# Altium project LimeSDR-Micro_M.2_2280_1v0.PrjPcb (part 10 of 10)
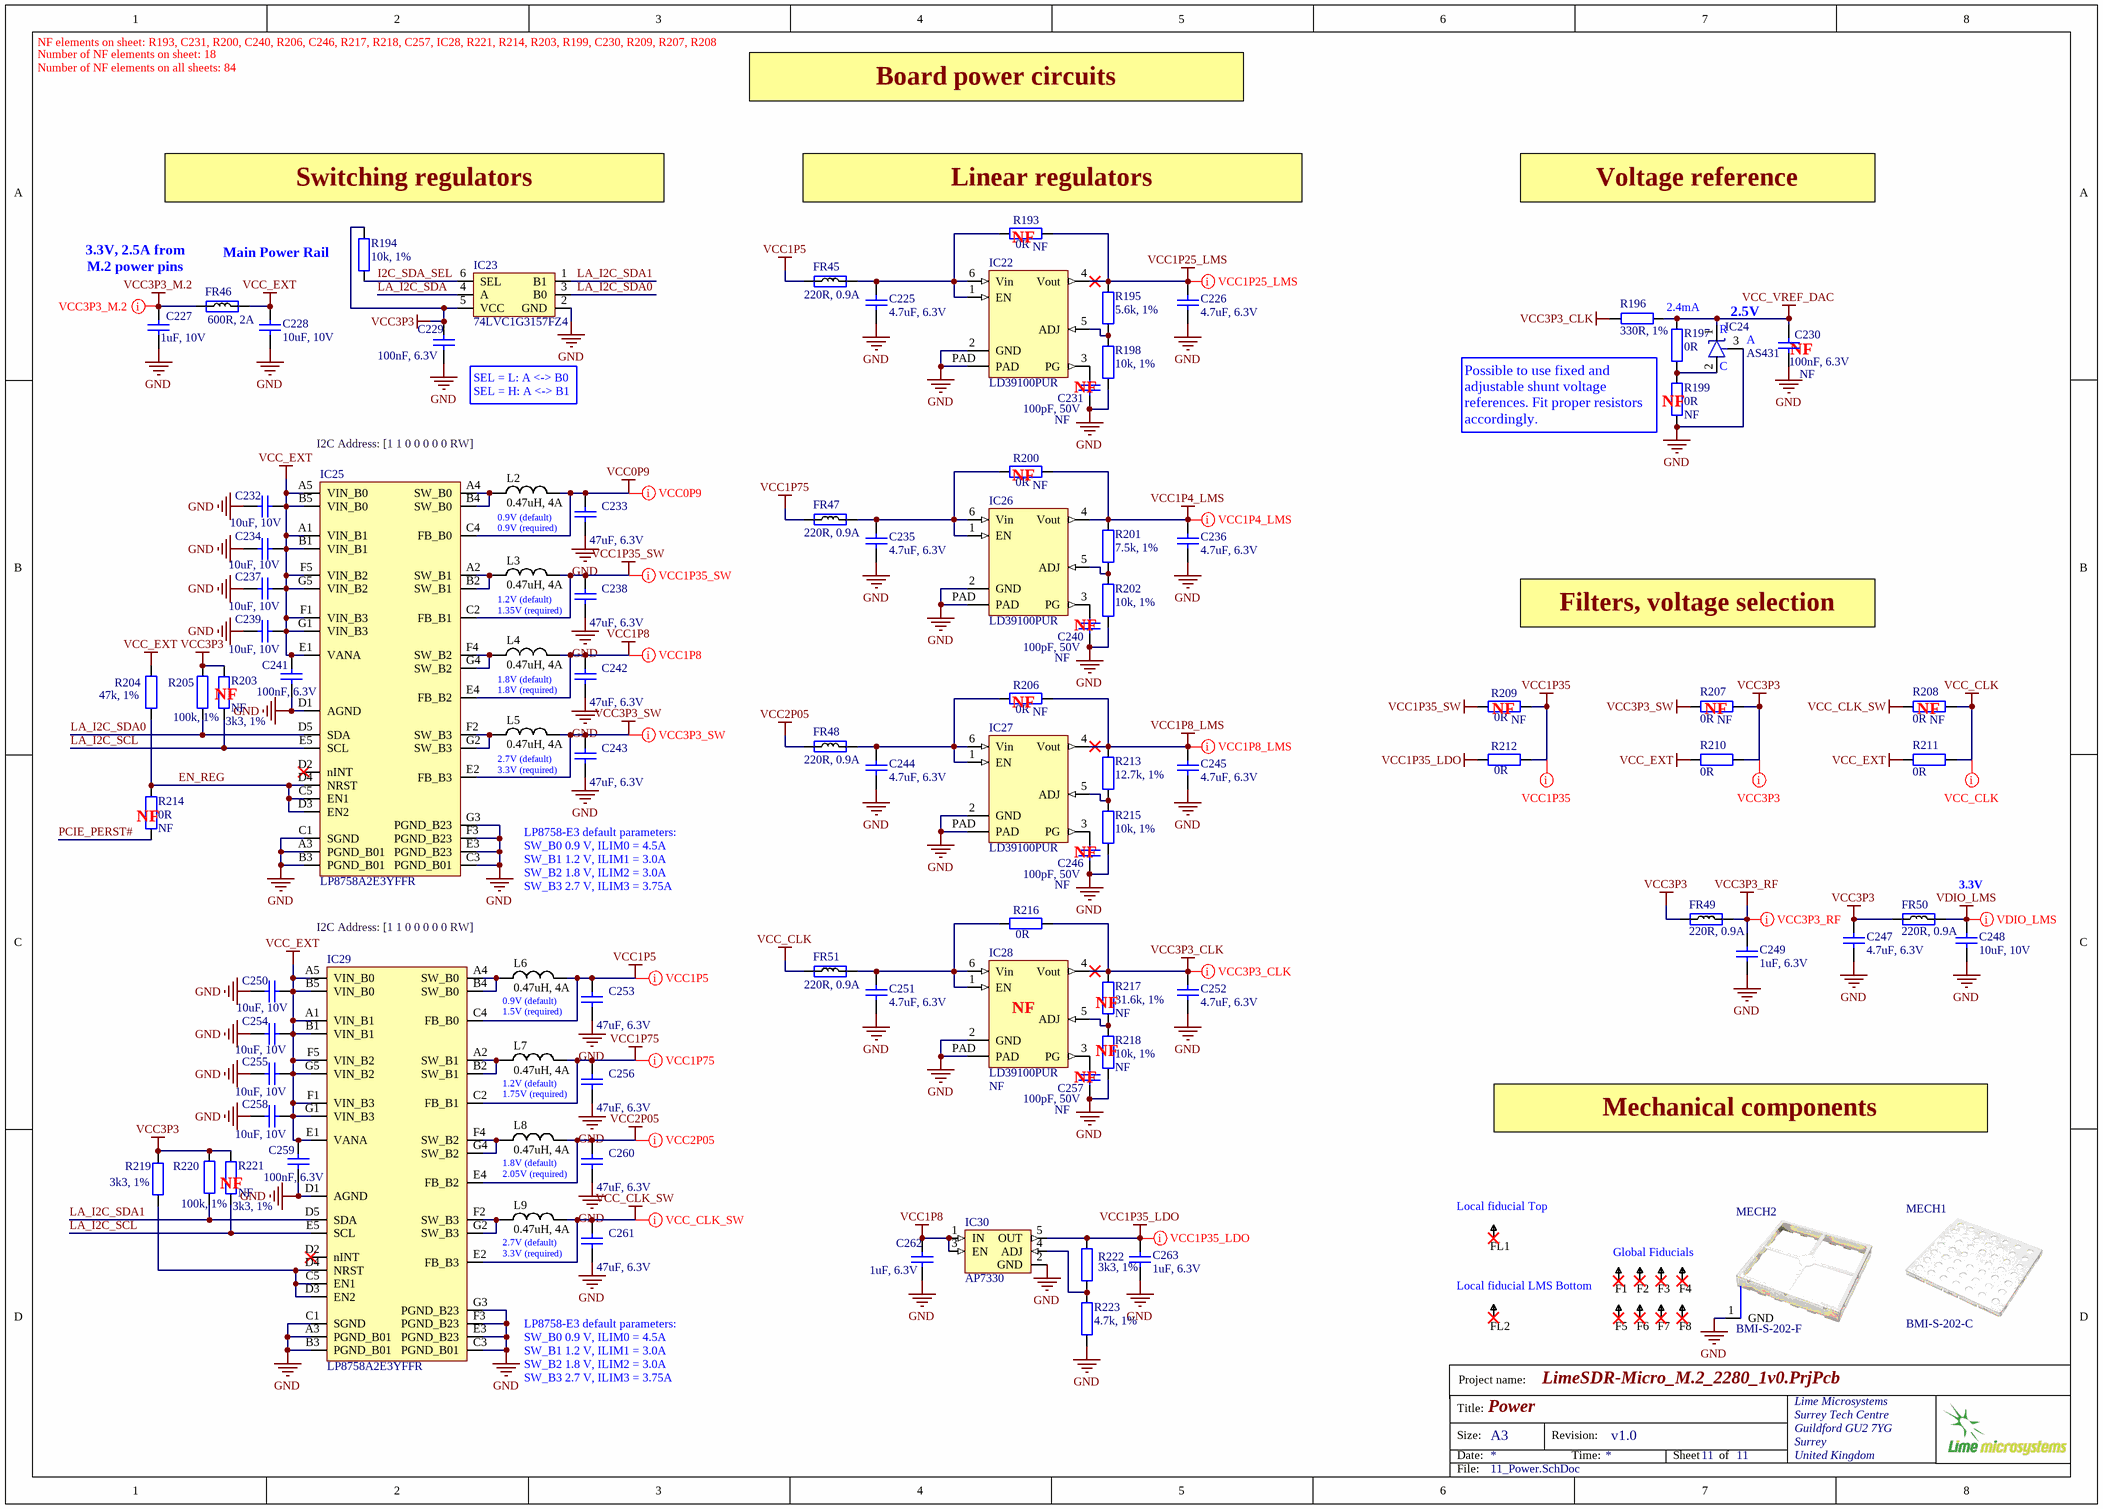
[diagram p16: 11_Power.SchDoc]

## Sheet 11_Power.SchDoc: Power (continued)

### Library data of the parts (continued)
R217 = Res_0402: Manufacturer: Yageo; Manufacturer Part Number 1: RC0201FR-0731K6L; Part Description: 31.6 kOhms ±1% 0.05W, 1/20W Chip Resistor 0201 (0603 Metric) Moisture Resistant Thick Film; Resistance: 31.6kR; Max Power Dissipation: 50mW; Temperature Coefficient: 200ppm/°C; Value: 31.6k, 1%; ComponentLink1URL: https://datasheet.ciiva.com/5924/1563626-5924912.pdf?src-supplier=Farnell; ComponentLink1Description: https://datasheet.ciiva.com/5924/1563626-5924912.pdf?src-supplier=Farnell; ComponentLink2URL: https://datasheet.ciiva.com/22661/1563626-22661319.pdf?src-supplier=Element14; ComponentLink2Description: https://datasheet.ciiva.com/22661/1563626-22661319.pdf?src-supplier=Element14; ComponentLink3URL: https://datasheet.ciiva.com/7660/1421516-7660807.pdf?src-supplier=Element14; ComponentLink3Description: https://datasheet.ciiva.com/7660/1421516-7660807.pdf?src-supplier=Element14; ComponentLink4URL: https://datasheet.ciiva.com/46391/1421516-46391339.pdf?src-supplier=Element14; ComponentLink4Description: https://datasheet.ciiva.com/46391/1421516-46391339.pdf?src-supplier=Element14; ComponentLink5URL: https://datasheet.ciiva.com/2467/pyu-r-int-thick-7-2467110.pdf?src-supplier=Digi-Key; ComponentLink5Description: https://datasheet.ciiva.com/2467/pyu-r-int-thick-7-2467110.pdf?src-supplier=Digi-Key; ComponentLink6URL: https://datasheet.ciiva.com/2467/pyu-r-int-thick-7-2467111.pdf?src-supplier=Digi-Key; ComponentLink6Description: https://datasheet.ciiva.com/2467/pyu-r-int-thick-7-2467111.pdf?src-supplier=Digi-Key; ComponentLink7URL: https://datasheet.ciiva.com/2467/pyu-r-int-thick-7-2467109.pdf?src-supplier=Digi-Key; ComponentLink7Description: https://datasheet.ciiva.com/2467/pyu-r-int-thick-7-2467109.pdf?src-supplier=Digi-Key; Supplier 1: Digi-Key; Supplier Part Number 1: YAG2597CT-ND; Stock 1: 255391; Pricing 1: 1=0,10000, 10=0,03700, 100=0,01500, 1000=0,00672, 2500=0,00583, 5000=0,00482 (USD); RoHS: Yes; Case/Package: 0201; Case Code (Metric): 0603; Case Code (Imperial): 0201; Min Operating Temperature: -55°C; Max Operating Temperature: 125°C; Packaging: Tape and Reel; Resistor Type: Thick Film; Number of Terminations: 2; Tolerance: 1%; Features: Moisture Resistant; Length: 0.024inch; Width: 0.012inch; Height: 0.01inch; RoHS Compliant: Yes; ComponentLink8URL: http://www.yageo.com/documents/recent/PYu-RC_Group_51_RoHS_L_10.pdf?src-supplier=Digi-Key; ComponentLink8Description: http://www.yageo.com/documents/recent/PYu-RC_Group_51_RoHS_L_10.pdf?src-supplier=Digi-Key; ComponentLink9URL: https://www.yageo.com/upload/media/product/productsearch/datasheet/rchip/PYu-RC_Group_51_RoHS_L_11.pdf?src-supplier=Digi-Key; ComponentLink9Description: https://www.yageo.com/upload/media/product/productsearch/datasheet/rchip/PYu-RC_Group_51_RoHS_L_11.pdf?src-supplier=Digi-Key; ComponentLink10URL: http://www.yageo.com/documents/recent/PYu-RC_Group_51_RoHS_L_9.pdf?src-supplier=Digi-Key; ComponentLink10Description: http://www.yageo.com/documents/recent/PYu-RC_Group_51_RoHS_L_9.pdf?src-supplier=Digi-Key
R223 = Res_0402: Manufacturer: Yageo; Manufacturer Part Number 1: RC0201FR-074K7L; Part Description: 4.7 kOhms ±1% 0.05W, 1/20W Chip Resistor 0201 (0603 Metric) Moisture Resistant Thick Film; Resistance: 4.7kR; Power Rating: 50mW; Voltage Rating: 25V; Temperature Coefficient: 200ppm/°C; Value: 4.7k, 1%; ComponentLink1URL: https://datasheet.ciiva.com/5924/1563626-5924912.pdf?src-supplier=Farnell; ComponentLink1Description: https://datasheet.ciiva.com/5924/1563626-5924912.pdf?src-supplier=Farnell; ComponentLink2URL: https://datasheet.ciiva.com/22661/1563626-22661319.pdf?src-supplier=Element14; ComponentLink2Description: https://datasheet.ciiva.com/22661/1563626-22661319.pdf?src-supplier=Element14; ComponentLink3URL: https://datasheet.ciiva.com/7672/1563626-7672202.pdf?src-supplier=Element14; ComponentLink3Description: https://datasheet.ciiva.com/7672/1563626-7672202.pdf?src-supplier=Element14; ComponentLink4URL: https://datasheet.ciiva.com/2493/pyu-r-int-thick-7-2493785.pdf?src-supplier=Digi-Key; ComponentLink4Description: https://datasheet.ciiva.com/2493/pyu-r-int-thick-7-2493785.pdf?src-supplier=Digi-Key; ComponentLink5URL: https://datasheet.ciiva.com/2493/pyu-r-int-thick-7-2493786.pdf?src-supplier=Digi-Key; ComponentLink5Description: https://datasheet.ciiva.com/2493/pyu-r-int-thick-7-2493786.pdf?src-supplier=Digi-Key; ComponentLink6URL: https://datasheet.ciiva.com/2493/pyu-r-int-thick-7-2493784.pdf?src-supplier=Digi-Key; ComponentLink6Description: https://datasheet.ciiva.com/2493/pyu-r-int-thick-7-2493784.pdf?src-supplier=Digi-Key; ComponentLink7URL: https://datasheet.ciiva.com/7672/1563626-7672233.pdf?src-supplier=Element14; ComponentLink7Description: https://datasheet.ciiva.com/7672/1563626-7672233.pdf?src-supplier=Element14; ComponentLink8URL: https://datasheet.ciiva.com/2493/pyu-r-int-thick-7-2493812.pdf?src-supplier=Digi-Key; ComponentLink8Description: https://datasheet.ciiva.com/2493/pyu-r-int-thick-7-2493812.pdf?src-supplier=Digi-Key; ComponentLink9URL: https://datasheet.ciiva.com/2493/pyu-r-int-thick-7-2493813.pdf?src-supplier=Digi-Key; ComponentLink9Description: https://datasheet.ciiva.com/2493/pyu-r-int-thick-7-2493813.pdf?src-supplier=Digi-Key; ComponentLink10URL: https://datasheet.ciiva.com/2493/pyu-r-int-thick-7-2493811.pdf?src-supplier=Digi-Key; ComponentLink10Description: https://datasheet.ciiva.com/2493/pyu-r-int-thick-7-2493811.pdf?src-supplier=Digi-Key; ComponentLink11URL: https://datasheet.ciiva.com/8892/pyu-rc0201-51-rohs-l-8-8892942.pdf?src-supplier=Avnet; ComponentLink11Description: https://datasheet.ciiva.com/8892/pyu-rc0201-51-rohs-l-8-8892942.pdf?src-supplier=Avnet; Supplier 1: Digi-Key; Supplier Part Number 1: 311-4.70KMCT-ND; Stock 1: 6149397; Pricing 1: 1=0,10000, 10=0,03700, 100=0,01530, 1000=0,00685, 2500=0,00595, 5000=0,00491 (USD); RoHS: Yes; Case/Package: 0201; Case Code (Metric): 0603; Case Code (Imperial): 0201; Weight: 6E-06oz; Contact Plating: Tin,Matte; Size Code: 0201; Min Operating Temperature: -55°C; Max Operating Temperature: 125°C; Tolerance: 1%; Packaging: Tape and Reel; Package Quantity: 1; Resistor Type: Thick Film; Number of Terminations: 2; Termination: SMD/SMT; Max Power Dissipation: 50mW; Features: Moisture Resistant; Series: RC; Resistance Tolerance: 1%; Construction: Rectangular; Length: 0.6mm; Width: 0.012inch; Height: 0.01inch; Depth: 0.3mm; Radiation Hardening: No; Military Standard: Not; Lead Free: Lead Free; RoHS Compliant: Yes

## Nets that join several sheets
GND: 05_LMS7002M_Misc (42 pins), 06_LMS7002M_RF (56 pins), 07_LMS7002M_Power (85 pins), 08_BB_Processor (131 pins), 09_Misc (74 pins), 10_Clock (76 pins), 11_Power (73 pins)
VCC0P9: 08_BB_Processor (16 pins), 11_Power (C233.2 IC25.C4 L2.2)
VCC1P4_LMS: 07_LMS7002M_Power (FR22.2 FR23.2 FR24.2 FR25.2), 11_Power (C236.2 IC26.4 R200.2 R201.1)
VCC1P8: 08_BB_Processor (13 pins), 09_Misc (31 pins), 10_Clock (6 pins), 11_Power (6 pins)
VCC1P8_LMS: 06_LMS7002M_RF (12 pins), 07_LMS7002M_Power (11 pins), 10_Clock (FR41.1), 11_Power (C245.2 IC27.4 R206.2 R213.1)
VCC1P25_LMS: 07_LMS7002M_Power (18 pins), 11_Power (C226.2 IC22.4 R193.2 R195.1)
VCC1P35: 08_BB_Processor (C117.1 R75.2), 11_Power (R209.2 R212.2)
VCC3P3: 05_LMS7002M_Misc (X6.8), 06_LMS7002M_RF (FR1.2), 08_BB_Processor (X13.8), 09_Misc (19 pins), 11_Power (13 pins)
VCC3P3_CLK: 08_BB_Processor (C133.2 C134.1 IC7.1), 09_Misc (FR38.1), 10_Clock (20 pins), 11_Power (5 pins)
VCC3P3_M.2: 08_BB_Processor (R74.1), 09_Misc (5 pins), 11_Power (C227.2 FR46.1)
VCC3P3_RF: 06_LMS7002M_RF (FR2.1 FR3.2 FR4.2), 11_Power (C249.1 FR49.2)
VCC_VREF_DAC: 10_Clock (R167.2), 11_Power (C230.1 IC24.1 R196.1 R197.1)
VDIO_LMS: 05_LMS7002M_Misc (9 pins), 07_LMS7002M_Power (R69.1), 11_Power (C248.2 FR50.2)
ADF_MUXOUT: 09_Misc (IC14.24), 10_Clock (IC20.15 R185.1)
EXT_CLK_CTRL: 09_Misc (IC14.22), 10_Clock (IC16.6)
GNSS_1PPS: 09_Misc (IC11.6), 10_Clock (R175.1)
GNSS_RXD_LS: 08_BB_Processor (IC6.P9), 09_Misc (IC12.3)
GNSS_TXD_LS: 08_BB_Processor (IC6.P10), 09_Misc (IC12.2)
I2C_SDA_SEL: 09_Misc (IC14.28), 11_Power (IC23.6 R194.1)
LA_CFG_BOOT_HO: 08_BB_Processor (IC6.R14), 09_Misc (R119.2 R128.1)
LA_CFG_BOOT_SRC0: 08_BB_Processor (IC6.M14), 09_Misc (IC8.4 R117.2 R125.1 R126.1)
LA_CFG_BOOT_SRC1: 08_BB_Processor (IC6.P15), 09_Misc (R118.2 R127.1)
LA_CFG_PCIE_GEN: 08_BB_Processor (IC6.P13), 09_Misc (R124.2 R133.1)
LA_CFG_RST_HNDSHK: 08_BB_Processor (IC6.P14), 09_Misc (IC9.1 R120.2 R129.1 R136.1)
LA_CFG_TEST_PORT_DIS: 08_BB_Processor (IC6.M15), 09_Misc (IC9.2 R121.2 R130.1 R134.1)
LA_GPIO_05: 08_BB_Processor (IC6.L13), 09_Misc (R137.1)
LA_GPIO_06: 08_BB_Processor (IC6.K15), 09_Misc (R138.1)
LA_I2C_SCL: 05_LMS7002M_Misc (R26.1), 09_Misc (7 pins), 10_Clock (IC18.5), 11_Power (IC25.E5 IC29.E5 R203.2 R221.2)
LA_I2C_SCL_LS: 08_BB_Processor (IC6.P6), 09_Misc (R144.2 VT1.S)
LA_I2C_SDA: 05_LMS7002M_Misc (R30.1), 09_Misc (6 pins), 10_Clock (IC18.6), 11_Power (IC23.4)
LA_I2C_SDA_LS: 08_BB_Processor (IC6.R6), 09_Misc (R147.2 VT2.S)
LA_LED1_LS: 08_BB_Processor (IC6.R11), 09_Misc (IC9.4)
LA_LED2_LS: 08_BB_Processor (IC6.P12), 09_Misc (IC9.3)
LA_PPS_IN_LS: 08_BB_Processor (IC6.K14), 10_Clock (IC19.4 R181.2)
LA_PPS_OUT_LS: 08_BB_Processor (IC6.M8), 09_Misc (R122.2 R131.1), 10_Clock (IC21.4 R192.2)
LA_RX0_I_N: 05_LMS7002M_Misc (R28.1), 08_BB_Processor (IC6.A4)
LA_RX0_I_P: 05_LMS7002M_Misc (R34.1), 08_BB_Processor (IC6.B4)
LA_RX0_Q_N: 05_LMS7002M_Misc (R37.1), 08_BB_Processor (IC6.B6)
LA_RX0_Q_P: 05_LMS7002M_Misc (R42.1), 08_BB_Processor (IC6.A6)
LA_RX1_I_N: 05_LMS7002M_Misc (R44.1), 08_BB_Processor (IC6.B10)
LA_RX1_I_P: 05_LMS7002M_Misc (R49.1), 08_BB_Processor (IC6.A10)
LA_RX1_Q_N: 05_LMS7002M_Misc (R51.1), 08_BB_Processor (IC6.A12)
LA_RX1_Q_P: 05_LMS7002M_Misc (R58.1), 08_BB_Processor (IC6.B12)
LA_SPI_ADF_SS: 09_Misc (IC12.12), 10_Clock (R190.2)
LA_SPI_ADF_SS_LS: 08_BB_Processor (IC6.P11), 09_Misc (IC12.1 R115.2)
LA_SPI_LMS_SS: 05_LMS7002M_Misc (R23.2), 09_Misc (IC12.9)
LA_SPI_LMS_SS_LS: 08_BB_Processor (IC6.P7), 09_Misc (IC12.4 R116.2)
LA_SPI_MISO: 05_LMS7002M_Misc (R22.2), 09_Misc (IC8.11)
LA_SPI_MISO_LS: 08_BB_Processor (IC6.R8), 09_Misc (IC8.2)
LA_SPI_MOSI: 05_LMS7002M_Misc (R21.2), 09_Misc (IC8.12), 10_Clock (R189.2)
LA_SPI_MOSI_LS: 08_BB_Processor (IC6.R9), 09_Misc (IC8.1 R123.2 R132.1)
LA_SPI_SCLK: 05_LMS7002M_Misc (R20.2), 09_Misc (IC8.10), 10_Clock (R187.2)
LA_SPI_SCLK_LS: 08_BB_Processor (IC6.P8), 09_Misc (IC8.3)
LA_TX_I_N: 05_LMS7002M_Misc (C2.1 C3.1 R4.1 R5.2), 08_BB_Processor (IC6.B7)
LA_TX_I_P: 05_LMS7002M_Misc (C1.2 C2.2 R1.2 R2.1), 08_BB_Processor (IC6.A7)
LA_TX_Q_N: 05_LMS7002M_Misc (C5.1 C6.1 R18.1 R19.2), 08_BB_Processor (IC6.B9)
LA_TX_Q_P: 05_LMS7002M_Misc (C4.2 C5.2 R14.2 R16.1), 08_BB_Processor (IC6.A9)
LMS_MCLK1: 05_LMS7002M_Misc (IC1.AB34 R7.1), 08_BB_Processor (R84.1)
LMS_RESET: 05_LMS7002M_Misc (IC1.E27 R10.1), 09_Misc (IC14.17)
LMS_RxPLL_CLK: 05_LMS7002M_Misc (IC1.AM24), 10_Clock (C185.2 R155.2)
LMS_TxPLL_CLK: 05_LMS7002M_Misc (IC1.E5), 10_Clock (C184.2 R154.2)
M.2_CLK_IN: 09_Misc (X9.P28), 10_Clock (R156.1)
M.2_CLK_OUT: 09_Misc (X9.P24), 10_Clock (R161.2)
M.2_PPS_IN: 09_Misc (X9.P46), 10_Clock (R172.1)
M.2_PPS_OUT: 09_Misc (X9.P48), 10_Clock (R188.1)
PCIE_PER0_N: 08_BB_Processor (C125.1), 09_Misc (X9.P47)
PCIE_PER0_P: 08_BB_Processor (C118.1), 09_Misc (X9.P49)
PCIE_PERST#: 08_BB_Processor (D1.C R74.2), 09_Misc (R140.2 X9.P50), 11_Power (R214.1)
PCIE_PET0_N: 08_BB_Processor (C116.1), 09_Misc (X9.P41)
PCIE_PET0_P: 08_BB_Processor (C114.1), 09_Misc (X9.P43)
PCIE_REF_CLK_N: 08_BB_Processor (C113.1), 09_Misc (X9.P53)
PCIE_REF_CLK_P: 08_BB_Processor (C112.1), 09_Misc (X9.P55)
PCIE_W_DISABLE2#: 08_BB_Processor (R76.1), 09_Misc (R145.2 X9.P26)
RX_SW2: 06_LMS7002M_RF (R60.2), 09_Misc (IC14.25)
RX_SW3: 06_LMS7002M_RF (R61.2), 09_Misc (IC14.27)
SMB_CLK_CTRL: 09_Misc (IC14.23), 10_Clock (IC17.6 R160.1)
TX_SW: 06_LMS7002M_RF (R59.2), 09_Misc (IC14.26)